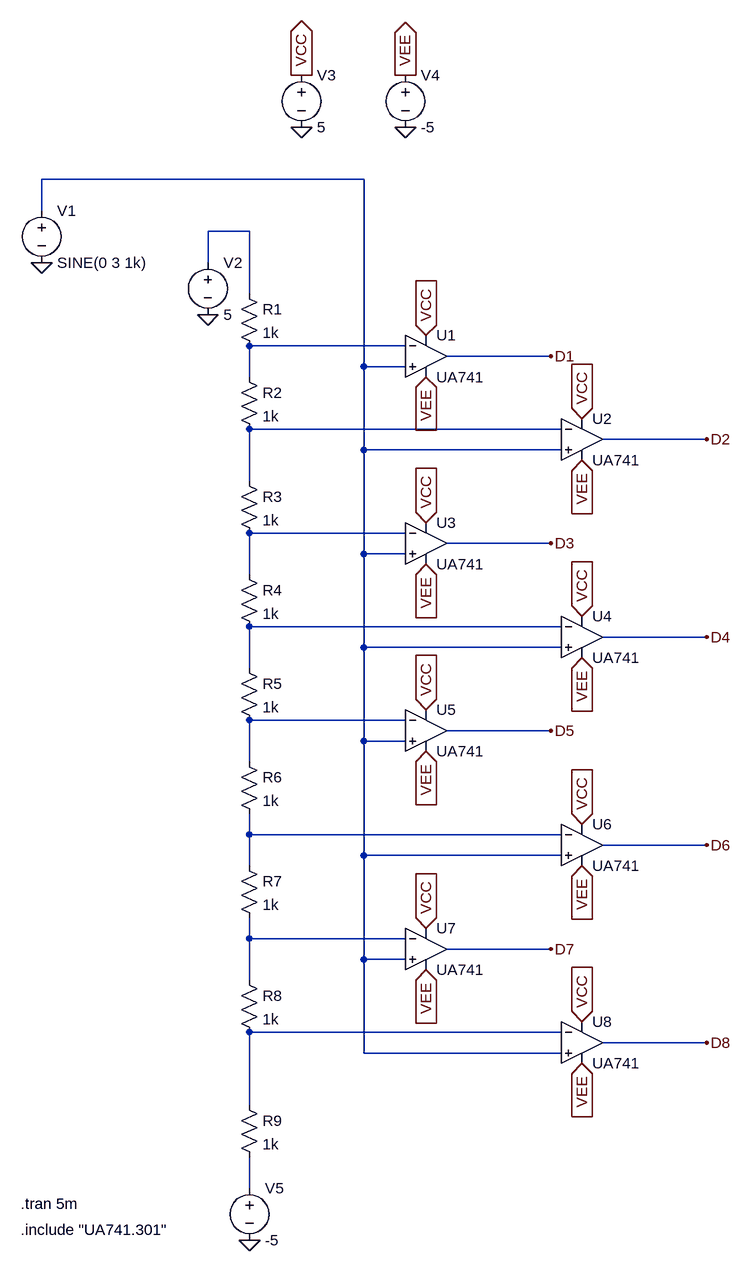
[diagram p0: schematic quan.asc]
quan.asc, the LTspice schematic file:
Version 4.1
SHEET 1 880 1460
WIRE 112 -192 -384 -192
WIRE -384 -144 -384 -192
WIRE -64 -112 -128 -112
WIRE -128 -64 -128 -112
WIRE -64 -16 -64 -112
WIRE 176 64 -64 64
WIRE 400 80 240 80
WIRE 112 96 112 -192
WIRE 176 96 112 96
WIRE -64 112 -64 64
WIRE 416 192 -64 192
WIRE 640 208 480 208
WIRE 112 224 112 96
WIRE 416 224 112 224
WIRE -64 272 -64 192
WIRE 176 352 -64 352
WIRE 400 368 240 368
WIRE 112 384 112 224
WIRE 176 384 112 384
WIRE -64 416 -64 352
WIRE 416 496 -64 496
WIRE 640 512 480 512
WIRE 112 528 112 384
WIRE 416 528 112 528
WIRE -64 560 -64 496
WIRE 176 640 -64 640
WIRE 400 656 240 656
WIRE 112 672 112 528
WIRE 176 672 112 672
WIRE -64 704 -64 640
WIRE -64 816 -64 784
WIRE 416 816 -64 816
WIRE 640 832 480 832
WIRE 112 848 112 672
WIRE 416 848 112 848
WIRE -64 864 -64 816
WIRE -64 976 -64 944
WIRE 176 976 -64 976
WIRE 400 992 240 992
WIRE 112 1008 112 848
WIRE 176 1008 112 1008
WIRE -64 1040 -64 976
WIRE 416 1120 -64 1120
WIRE 640 1136 480 1136
WIRE 112 1152 112 1008
WIRE 416 1152 112 1152
WIRE -64 1232 -64 1120
WIRE -64 1360 -64 1312
FLAG -384 -64 0
FLAG -128 16 0
FLAG 16 -352 VCC
IOPIN 16 -352 Out
FLAG 176 -352 VEE
IOPIN 176 -352 Out
FLAG 208 48 VCC
IOPIN 208 48 In
FLAG 448 176 VCC
IOPIN 448 176 In
FLAG 208 336 VCC
IOPIN 208 336 In
FLAG 448 480 VCC
IOPIN 448 480 In
FLAG 208 624 VCC
IOPIN 208 624 In
FLAG 448 800 VCC
IOPIN 448 800 In
FLAG 208 960 VCC
IOPIN 208 960 In
FLAG 448 1104 VCC
IOPIN 448 1104 In
FLAG 208 112 VEE
IOPIN 208 112 In
FLAG 448 240 VEE
IOPIN 448 240 In
FLAG 208 400 VEE
IOPIN 208 400 In
FLAG 448 544 VEE
IOPIN 448 544 In
FLAG 208 688 VEE
IOPIN 208 688 In
FLAG 448 864 VEE
IOPIN 448 864 In
FLAG 208 1024 VEE
IOPIN 208 1024 In
FLAG 448 1168 VEE
IOPIN 448 1168 In
FLAG 16 -272 0
FLAG 176 -272 0
FLAG 400 80 D1
FLAG 640 208 D2
FLAG 400 368 D3
FLAG 640 512 D4
FLAG 400 656 D5
FLAG 640 832 D6
FLAG 400 992 D7
FLAG 640 1136 D8
FLAG -64 1440 0
SYMBOL voltage -384 -160 R0
WINDOW 123 0 0 Left 0
WINDOW 39 0 0 Left 0
SYMATTR InstName V1
SYMATTR Value SINE(0 3 1k)
SYMBOL voltage -128 -80 R0
WINDOW 123 0 0 Left 0
WINDOW 39 0 0 Left 0
SYMATTR InstName V2
SYMATTR Value 5
SYMBOL res -80 -32 R0
SYMATTR InstName R1
SYMATTR Value 1k
SYMBOL res -80 96 R0
SYMATTR InstName R2
SYMATTR Value 1k
SYMBOL res -80 256 R0
SYMATTR InstName R3
SYMATTR Value 1k
SYMBOL res -80 400 R0
SYMATTR InstName R4
SYMATTR Value 1k
SYMBOL res -80 544 R0
SYMATTR InstName R5
SYMATTR Value 1k
SYMBOL res -80 688 R0
SYMATTR InstName R6
SYMATTR Value 1k
SYMBOL res -80 848 R0
SYMATTR InstName R7
SYMATTR Value 1k
SYMBOL res -80 1024 R0
SYMATTR InstName R8
SYMATTR Value 1k
SYMBOL res -80 1216 R0
SYMATTR InstName R9
SYMATTR Value 1k
SYMBOL OpAmps\\opamp2 208 16 R0
SYMATTR InstName U1
SYMATTR Value UA741
SYMBOL OpAmps\\opamp2 448 144 R0
SYMATTR InstName U2
SYMATTR Value UA741
SYMBOL OpAmps\\opamp2 208 304 R0
SYMATTR InstName U3
SYMATTR Value UA741
SYMBOL OpAmps\\opamp2 448 448 R0
SYMATTR InstName U4
SYMATTR Value UA741
SYMBOL OpAmps\\opamp2 208 592 R0
SYMATTR InstName U5
SYMATTR Value UA741
SYMBOL OpAmps\\opamp2 448 768 R0
SYMATTR InstName U6
SYMATTR Value UA741
SYMBOL OpAmps\\opamp2 208 928 R0
SYMATTR InstName U7
SYMATTR Value UA741
SYMBOL OpAmps\\opamp2 448 1072 R0
SYMATTR InstName U8
SYMATTR Value UA741
SYMBOL voltage 16 -368 R0
WINDOW 123 0 0 Left 0
WINDOW 39 0 0 Left 0
SYMATTR InstName V3
SYMATTR Value 5
SYMBOL voltage 176 -368 R0
WINDOW 123 0 0 Left 0
WINDOW 39 0 0 Left 0
SYMATTR InstName V4
SYMATTR Value -5
SYMBOL voltage -64 1344 R0
WINDOW 123 0 0 Left 0
WINDOW 39 0 0 Left 0
SYMATTR InstName V5
SYMATTR Value -5
TEXT -416 1384 Left 2 !.tran 5m
TEXT -416 1424 Left 2 !.include "UA741.301"

The netlist it stands for:
* quan.asc
V1 N001 0 SINE(0 3 1k)
V2 N002 0 5
R1 N002 N003 1k
R2 N003 N004 1k
R3 N004 N005 1k
R4 N005 N006 1k
R5 N006 N007 1k
R6 N007 N008 1k
R7 N008 N009 1k
R8 N009 N010 1k
R9 N010 N011 1k
X§U1 N001 N003 VCC VEE D1 UA741  ; pins In+ In- V+ V- OUT
X§U2 N001 N004 VCC VEE D2 UA741  ; pins In+ In- V+ V- OUT
X§U3 N001 N005 VCC VEE D3 UA741  ; pins In+ In- V+ V- OUT
X§U4 N001 N006 VCC VEE D4 UA741  ; pins In+ In- V+ V- OUT
X§U5 N001 N007 VCC VEE D5 UA741  ; pins In+ In- V+ V- OUT
X§U6 N001 N008 VCC VEE D6 UA741  ; pins In+ In- V+ V- OUT
X§U7 N001 N009 VCC VEE D7 UA741  ; pins In+ In- V+ V- OUT
X§U8 N001 N010 VCC VEE D8 UA741  ; pins In+ In- V+ V- OUT
V3 VCC 0 5
V4 VEE 0 -5
V5 N011 0 -5
.tran 5m
.include "UA741.301"
.backanno
.end